# EAGLE design attinier85-motherboard-pth-mk-3.0 (EAGLE 7.5.0)
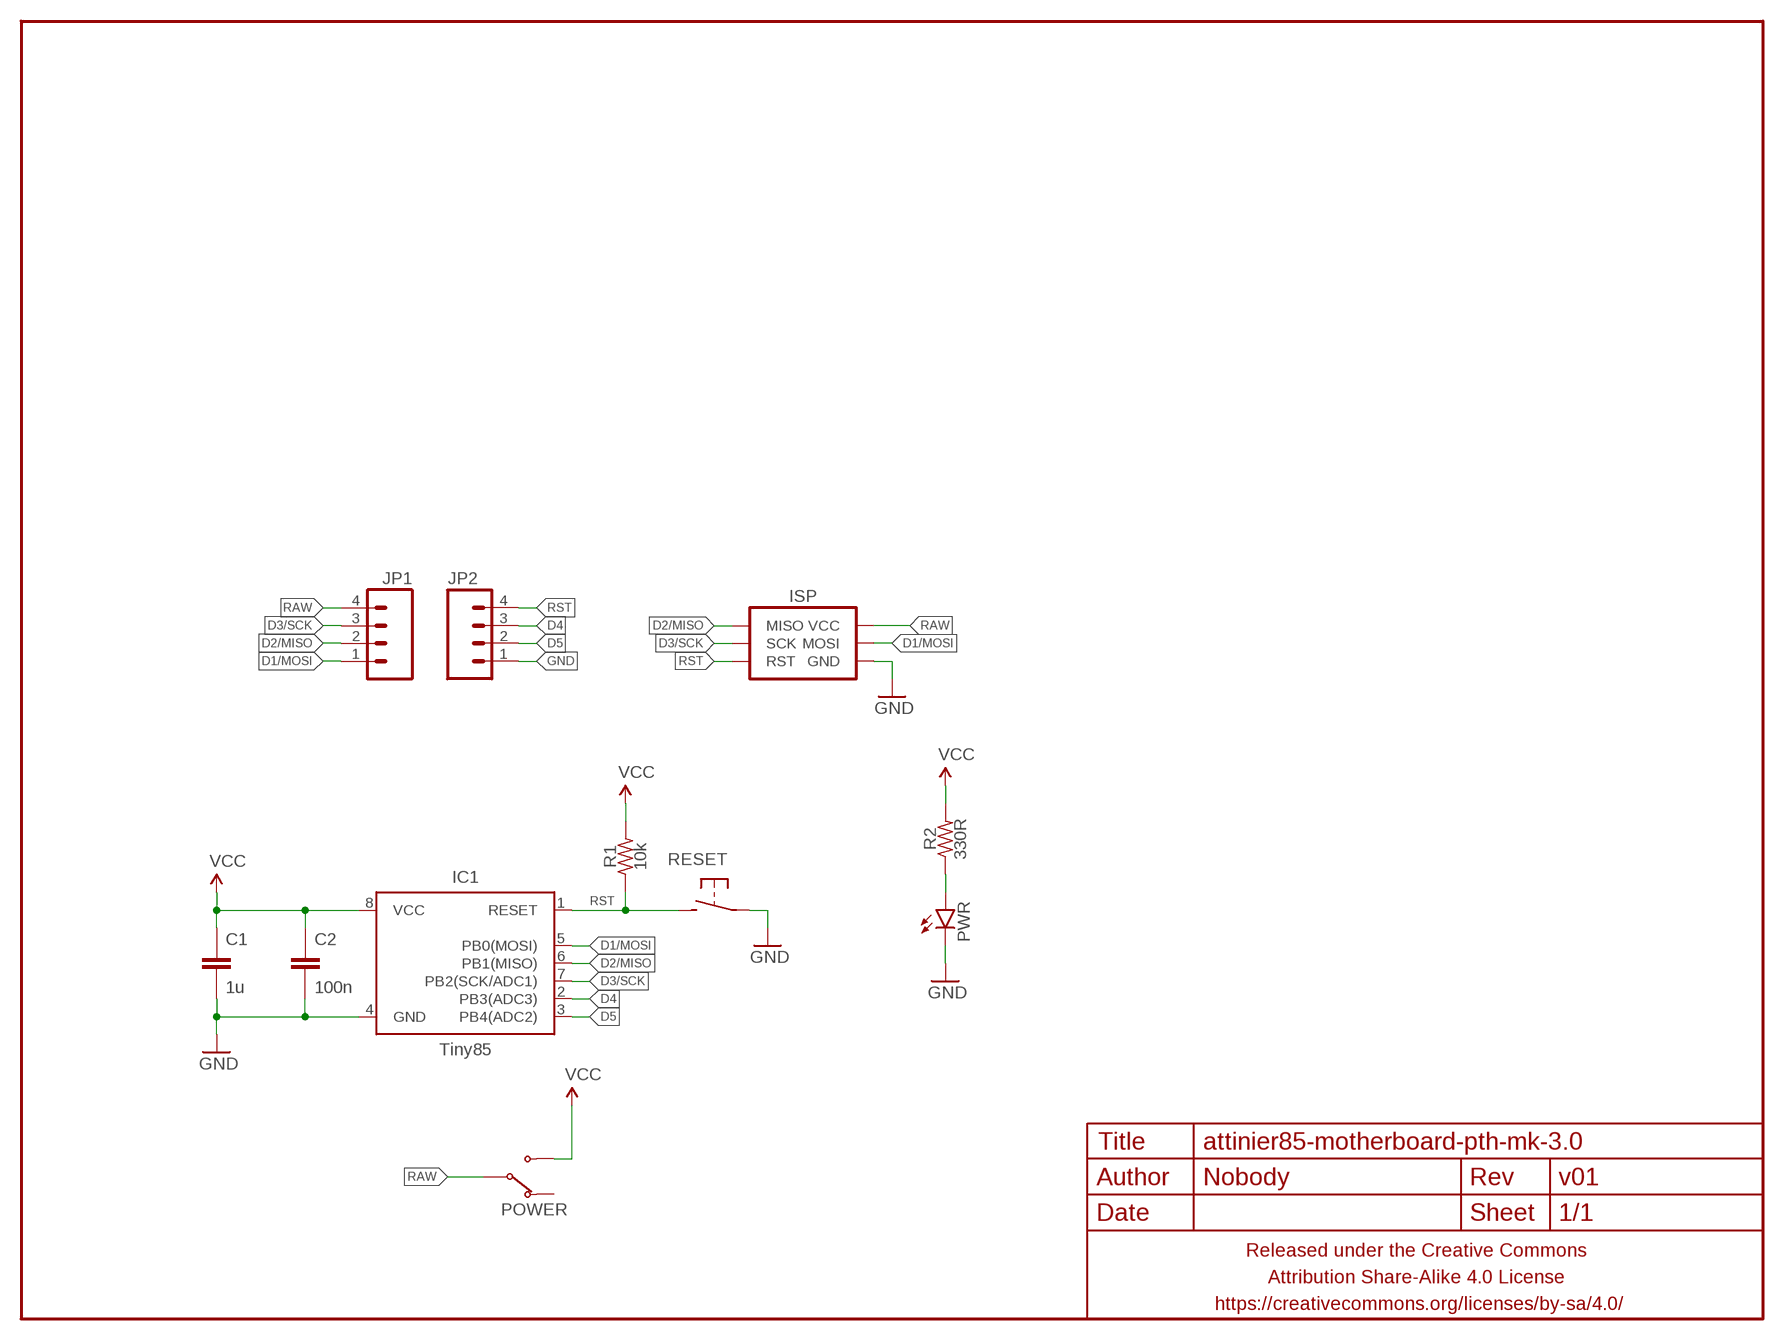
[diagram p0: schematic, sheet 1]

## Parts
C1  1u  CAPACITOR-CERAMICC0603  [C0603]
C2  100n  CAPACITOR-CERAMICC0603  [C0603]
FRAME1  FRAME-LETTERNO_PACKAGE  [DUMMY]
IC1  Tiny85  ATTINY45TINY85-20-SOICW  [SO08-EIAJ]
ISP  AVR_SPI_PRG_62X3_SMD  [2X3_SMD]
JP1  M04PTH  [1X04-PTH-VERT]
JP2  M04PTH  [1X04-PTH-VERT]
POWER  SWITCH-SPDTSMD-RA  [SWITCH-SPDT-SMD-RA]
PWR  LED0603  [LED-0603]
R1  10k  RESISTORR0603  [R0603]
R2  330R  RESISTORR0603  [R0603]
RESET  DTS-6MM  SPST-NO-TACTB3U-1000P  [B3U-1000P]

## Nets
D1/MOSI: IC1.5(PB0(MOSI)) ISP.4(MOSI) JP1.1
D2/MISO: IC1.6(PB1(MISO)) ISP.1(MISO) JP1.2
D3/SCK: IC1.7(PB2(SCK/ADC1)) ISP.3(SCK) JP1.3
D4: IC1.2(PB3(ADC3)) JP2.3
D5: IC1.3(PB4(ADC2)) JP2.2
GND: C1.2 C2.2 IC1.4(GND) ISP.6(GND) JP2.1 PWR.C RESET.0
N$1: PWR.A R2.1
RAW: ISP.2(VCC) JP1.4 POWER.2(COM)
RST: IC1.1(RESET) ISP.5(RST) JP2.4 R1.1 RESET.1
VCC: C1.1 C2.1 IC1.8(VCC) POWER.1(NO) R1.2 R2.2
Unconnected: POWER.3(NC)

## Library data of the parts
C1 C2 = a_parts:CAPACITOR-CERAMIC: CAPACITOR, European symbol
FRAME1 = a_parts:FRAME-LETTER: Schematic Frame Standard 8.5x11 US Letter frame; DESIGNER: Nobody; VERSION: v01
IC1 = a_parts:ATTINY45: Atmel 8-pin 2/4/8kB flash uC; PROD_ID: IC-09092; VALUE: Tiny85-20-SMT
ISP = a_parts:AVR_SPI_PRG_6: AVR ISP 6 Pin This is the reduced ISP connector for AVR programming. Common on Arduino. This footprint will take up less PCB space and can be used with a 10-pin to 6-pin adapter such as SKU: BOB-08508 **Special note about "TEST_POINT" package. The stop mask is on the top side, so if you want your programming test points to be on the bottom of your board, make sure to place this package on the bottom side of the board. This also ensure that the orientation to program from the bottom side will be correct.
JP1 JP2 = a_parts:M04: Header 4 Standard 4-pin 0.1" header. Use with straight break away headers (SKU : PRT-00116), right angle break away headers (PRT-00553), swiss pins (PRT-00743), machine pins (PRT-00117), and female headers (PRT-00115). Molex polarized connector foot print use with SKU : PRT-08231 with associated crimp pins and housings. 1MM SMD Version SKU: PRT-10208
POWER = a_parts:SWITCH-SPDT
PWR = a_parts:LED: LEDs Standard schematic elements and footprints for 5mm, 3mm, 1206, and 0603 sized LEDs. 5mm - Spark Fun Electronics SKU : COM-00529 (and others)
R1 R2 = a_parts:RESISTOR: RESISTOR, American symbol
RESET = a_parts:SPST-NO-TACT

## Board
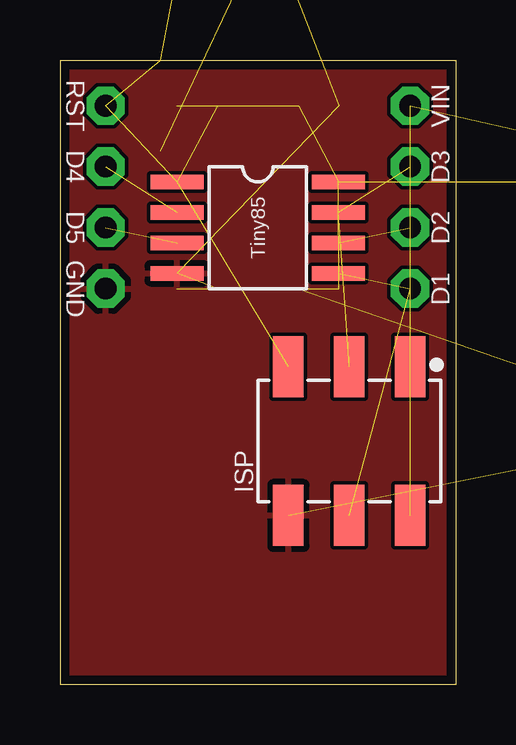
[diagram p1: board, top side]
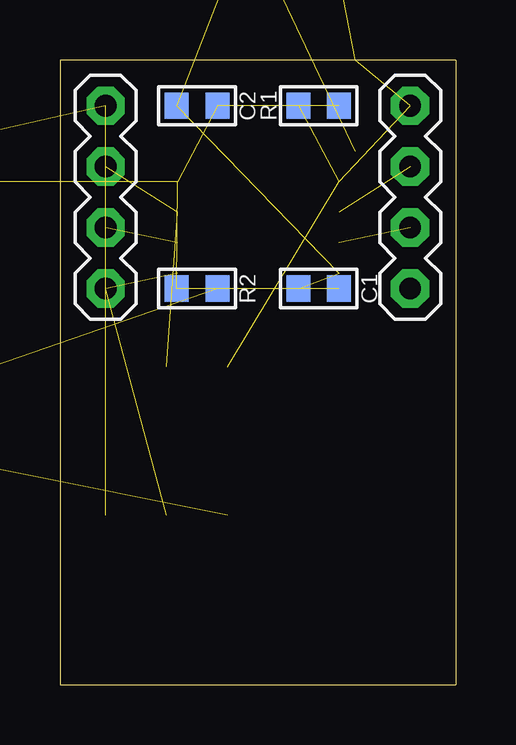
[diagram p2: board, bottom side, seen from below]

Size 16.51 x 26.04 mm. Coordinates in mm from the lower left corner, seen from the top.
Outline: 0,26.04 16.51,26.04 16.51,0 0,0 0,26.04
Copper layers (1*16): Top 0.0356mm / dielectric 1.5011mm / Bottom 0.0356mm
Design rules "LaenPCBOrder2": minimum track width 6mil, minimum drill 13mil, track to track 6mil, track to pad 6mil, pad to pad 6mil, via to via 6mil, smd to smd 6mil, copper to edge 15mil, drill to drill 6mil, minimum pad ring 7mil, minimum via ring 7mil, stop-mask expansion 3mil, vias tented up to drill 20mil, thermal gap 10mil

### Footprints (pad centres in the part's own frame; a part is rotated, then mirrored left to right if it is on the bottom)
C0603 = smd 1 x 1.1: 1 -0.85,0; 2 0.85,0
SO08-EIAJ = smd 0.61 x 2.21: 1 -1.905,-3.378; 2 -0.635,-3.378; 3 0.635,-3.378; 4 1.905,-3.378; 5 1.905,3.353; 6 0.635,3.353; 7 -0.635,3.353; 8 -1.905,3.353
2X3_SMD = smd 1.27 x 2.54: 1 -2.54,-3.1; 2 -2.54,3.1; 3 0,-3.1; 4 0,3.1; 5 2.54,-3.1; 6 2.54,3.1
1X04-PTH-VERT = drill 0.9 pad 1.6 octagon: 1 0,0; 2 2.54,0; 3 5.08,0; 4 7.62,0
SWITCH-SPDT-SMD-RA = smd 1.2 x 2.5: 1 -2.5,0; 2 0,0; 3 2.5,0 | hole 0.9: -3.4,-2.75; 3.4,-2.75
LED-0603 = smd 1.1 x 1: A 0,-0.85; C 0,0.85
R0603 = smd 1 x 1.1: 1 -0.85,0; 2 0.85,0
B3U-1000P = smd 0.8 x 1.7: 0 1.7,0; 1 -1.7,0

### Placement (x,y rotation side)
C1  5.72,16.51 180 bottom
C2  10.8,24.13 180 bottom
FRAME1  -3.17,0 0 top  (outside the outline)
IC1  8.25,19.05 270 top
ISP  12.07,10.16 180 top
JP1  14.61,16.51 90 bottom
JP2  1.91,16.51 90 bottom
POWER  28.57,20.95 180 top  (outside the outline)
PWR  27.3,10.79 270 top  (outside the outline)
R1  5.72,24.13 0 bottom
R2  10.8,16.51 180 bottom
RESET  6.99,31.75 0 top  (outside the outline)

### Tracks (layer width: path | path; a pad name or v marks a point on that pad's centre or on a via)
D1/MOSI  (2 unrouted)
D2/MISO  (2 unrouted)
D3/SCK  (2 unrouted)
D4  (1 unrouted)
D5  (1 unrouted)
GND  (5 unrouted)
  pour Top: 0,0 0,26.04 16.51,26.04 16.51,0
N$1  (1 unrouted)
RAW  (2 unrouted)
RST  (5 unrouted)
VCC  (5 unrouted)

### Text on the board
tNames: RST | VIN | D4 | D3 | D5 | D2 | GND | D1